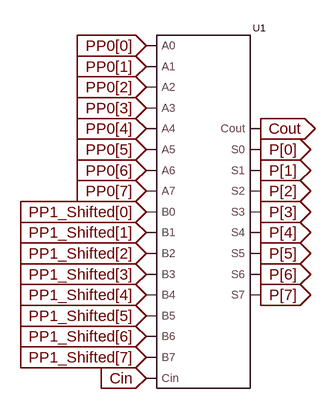
[diagram p0: schematic Summation_Block.asc]
Summation_Block.asc, the LTspice schematic file:
Version 4.1
SHEET 1 880 680
WIRE 128 -80 112 -80
WIRE 128 -48 112 -48
WIRE 128 -16 112 -16
WIRE 128 16 112 16
WIRE 128 48 112 48
WIRE 288 48 272 48
WIRE 128 80 112 80
WIRE 288 80 272 80
WIRE 128 112 112 112
WIRE 288 112 272 112
WIRE 128 144 112 144
WIRE 288 144 272 144
WIRE 128 176 112 176
WIRE 288 176 272 176
WIRE 128 208 112 208
WIRE 288 208 272 208
WIRE 128 240 112 240
WIRE 288 240 272 240
WIRE 128 272 112 272
WIRE 288 272 272 272
WIRE 128 304 112 304
WIRE 288 304 272 304
WIRE 128 336 112 336
WIRE 128 368 112 368
WIRE 128 400 112 400
WIRE 128 432 112 432
FLAG 112 -80 PP0[0]
IOPIN 112 -80 In
FLAG 112 -48 PP0[1]
IOPIN 112 -48 In
FLAG 112 -16 PP0[2]
IOPIN 112 -16 In
FLAG 112 16 PP0[3]
IOPIN 112 16 In
FLAG 112 48 PP0[4]
IOPIN 112 48 In
FLAG 112 80 PP0[5]
IOPIN 112 80 In
FLAG 112 112 PP0[6]
IOPIN 112 112 In
FLAG 112 144 PP0[7]
IOPIN 112 144 In
FLAG 112 176 PP1_Shifted[0]
IOPIN 112 176 In
FLAG 112 208 PP1_Shifted[1]
IOPIN 112 208 In
FLAG 112 240 PP1_Shifted[2]
IOPIN 112 240 In
FLAG 112 272 PP1_Shifted[3]
IOPIN 112 272 In
FLAG 112 304 PP1_Shifted[4]
IOPIN 112 304 In
FLAG 112 336 PP1_Shifted[5]
IOPIN 112 336 In
FLAG 112 368 PP1_Shifted[6]
IOPIN 112 368 In
FLAG 112 400 PP1_Shifted[7]
IOPIN 112 400 In
FLAG 112 432 Cin
IOPIN 112 432 In
FLAG 288 80 P[0]
IOPIN 288 80 Out
FLAG 288 112 P[1]
IOPIN 288 112 Out
FLAG 288 144 P[2]
IOPIN 288 144 Out
FLAG 288 176 P[3]
IOPIN 288 176 Out
FLAG 288 208 P[4]
IOPIN 288 208 Out
FLAG 288 240 P[5]
IOPIN 288 240 Out
FLAG 288 272 P[6]
IOPIN 288 272 Out
FLAG 288 304 P[7]
IOPIN 288 304 Out
FLAG 288 48 Cout
IOPIN 288 48 Out
SYMBOL 8_Bit_CLA 208 176 R0
SYMATTR InstName U1

The netlist it stands for:
* Summation_Block.asc
X§U1 PP0[0] PP0[1] PP0[2] PP0[3] PP0[4] PP0[5] PP0[6] PP0[7] PP1_Shifted[0] PP1_Shifted[1] PP1_Shifted[2] PP1_Shifted[3] PP1_Shifted[4] PP1_Shifted[5] PP1_Shifted[6] PP1_Shifted[7] Cin Cout P[0] P[1] P[2] P[3] P[4] P[5] P[6] P[7] 8_Bit_CLA  ; pins A0 A1 A2 A3 A4 A5 A6 A7 B0 B1 B2 B3 B4 B5 B6 B7 Cin Cout S0 S1 S2 S3 S4 S5 S6 S7
.lib 8_Bit_CLA.sub
.backanno
.end